# EAGLE schematic NinjaFuge-170925 (EAGLE 6.6.0)
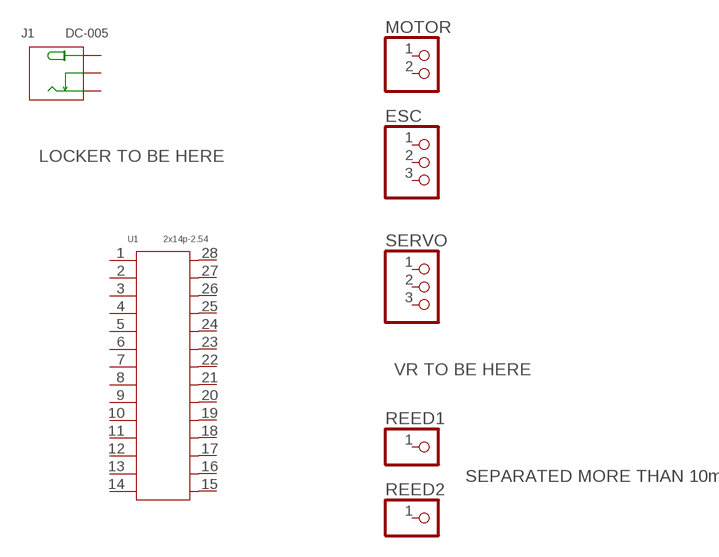
[diagram p0: schematic, sheet 1]

## Parts
ESC  PINHD-1X3  [1X03]
J1  DC-005  CONN-POWER-JACK-2.1MM(DC-005)  [DCJ3P-14.2X11.0X9.0MM]
MOTOR  PINHD-1X2  [1X02]
REED1  PINHD-1X1  [1X01]
REED2  PINHD-1X1  [1X01]
SERVO  PINHD-1X3  [1X03]
U1  2x14p-2.54  DIP-IC-SOCKET(2X14P-2.54)  [SCK28-2.54-35.6X10MM]
Unconnected: ESC.1 ESC.2 ESC.3 J1.+ J1.-1(-) J1.-2(CDN) MOTOR.1 MOTOR.2 REED1.1 REED2.1 SERVO.1 SERVO.2 SERVO.3 U1.1 U1.2 U1.3 U1.4 U1.5 U1.6 U1.7 U1.8 U1.9 U1.10 U1.11 U1.12 U1.13 U1.14 U1.15 U1.16 U1.17 U1.18 U1.19 U1.20 U1.21 U1.22 U1.23 U1.24 U1.25 U1.26 U1.27 U1.28

## Notes on the sheet
- LOCKER TO BE HERE
- VR TO BE HERE
- SEPARATED MORE THAN 10mm

## Library data of the parts
ESC SERVO = pinhead:PINHD-1X3: PIN HEADER
J1 = Seeed-Connector:CONN-POWER-JACK-2.1MM(DC-005): 320120003; MPN: DC-005
MOTOR = pinhead:PINHD-1X2: PIN HEADER
REED1 REED2 = pinhead:PINHD-1X1: PIN HEADER
U1 = Seeed-Connector:DIP-IC-SOCKET(2X14P-2.54): 320070000; MPN: ICX-28P